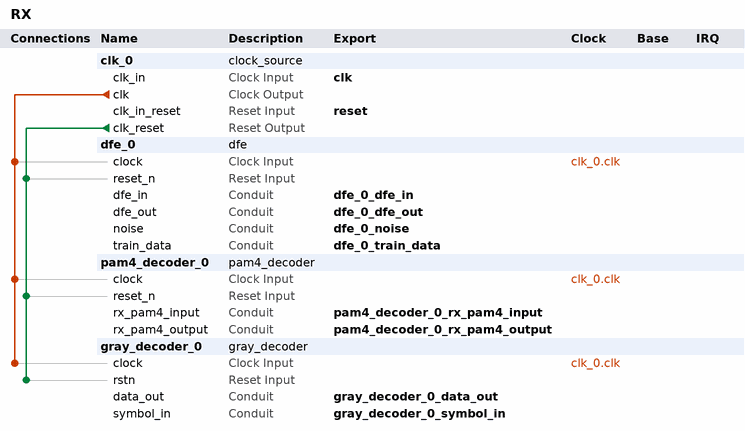
[diagram p0: system contents]
# Platform Designer (Qsys) system RX, Cyclone V 5CSEMA5F31C6
# Parameters at their usual value, and those the tool derives, are not listed.
package require -exact qsys 22.1
create_system RX
set_project_property DEVICE_FAMILY {Cyclone V}
set_project_property DEVICE 5CSEMA5F31C6

add_instance clk_0 clock_source 22.1
set_instance_parameter_value clk_0 clockFrequency 50000000

add_instance dfe_0 dfe 1.0
set_instance_parameter_value dfe_0 PULSE_RESPONSE_LENGTH 2
set_instance_parameter_value dfe_0 SIGNAL_RESOLUTION 8
set_instance_parameter_value dfe_0 SYMBOL_SEPERATION 56

add_instance pam4_decoder_0 pam4_decoder 1.0
set_instance_parameter_value pam4_decoder_0 SIGNAL_RESOLUTION 8
set_instance_parameter_value pam4_decoder_0 SYMBOL_SEPERATION 56

add_instance gray_decoder_0 gray_decoder 1.0

# connections
add_connection clk_0.clk dfe_0.clock clock
add_connection clk_0.clk gray_decoder_0.clock clock
add_connection clk_0.clk pam4_decoder_0.clock clock
add_connection clk_0.clk_reset dfe_0.reset_n reset
add_connection clk_0.clk_reset gray_decoder_0.rstn reset
add_connection clk_0.clk_reset pam4_decoder_0.reset_n reset

# exported interfaces
add_interface clk clock sink
set_interface_property clk EXPORT_OF clk_0.clk_in
add_interface dfe_0_dfe_in conduit end
set_interface_property dfe_0_dfe_in EXPORT_OF dfe_0.dfe_in
add_interface dfe_0_dfe_out conduit end
set_interface_property dfe_0_dfe_out EXPORT_OF dfe_0.dfe_out
add_interface dfe_0_noise conduit end
set_interface_property dfe_0_noise EXPORT_OF dfe_0.noise
add_interface dfe_0_train_data conduit end
set_interface_property dfe_0_train_data EXPORT_OF dfe_0.train_data
add_interface gray_decoder_0_data_out conduit end
set_interface_property gray_decoder_0_data_out EXPORT_OF gray_decoder_0.data_out
add_interface gray_decoder_0_symbol_in conduit end
set_interface_property gray_decoder_0_symbol_in EXPORT_OF gray_decoder_0.symbol_in
add_interface pam4_decoder_0_rx_pam4_input conduit end
set_interface_property pam4_decoder_0_rx_pam4_input EXPORT_OF pam4_decoder_0.rx_pam4_input
add_interface pam4_decoder_0_rx_pam4_output conduit end
set_interface_property pam4_decoder_0_rx_pam4_output EXPORT_OF pam4_decoder_0.rx_pam4_output
add_interface reset reset sink
set_interface_property reset EXPORT_OF clk_0.clk_in_reset

set_interconnect_requirement {$system} qsys_mm.clockCrossingAdapter HANDSHAKE
set_interconnect_requirement {$system} qsys_mm.enableEccProtection FALSE
set_interconnect_requirement {$system} qsys_mm.insertDefaultSlave FALSE
set_interconnect_requirement {$system} qsys_mm.maxAdditionalLatency 1

save_system RX.qsys
